# EAGLE design relayBoard (EAGLE 7.5.0)
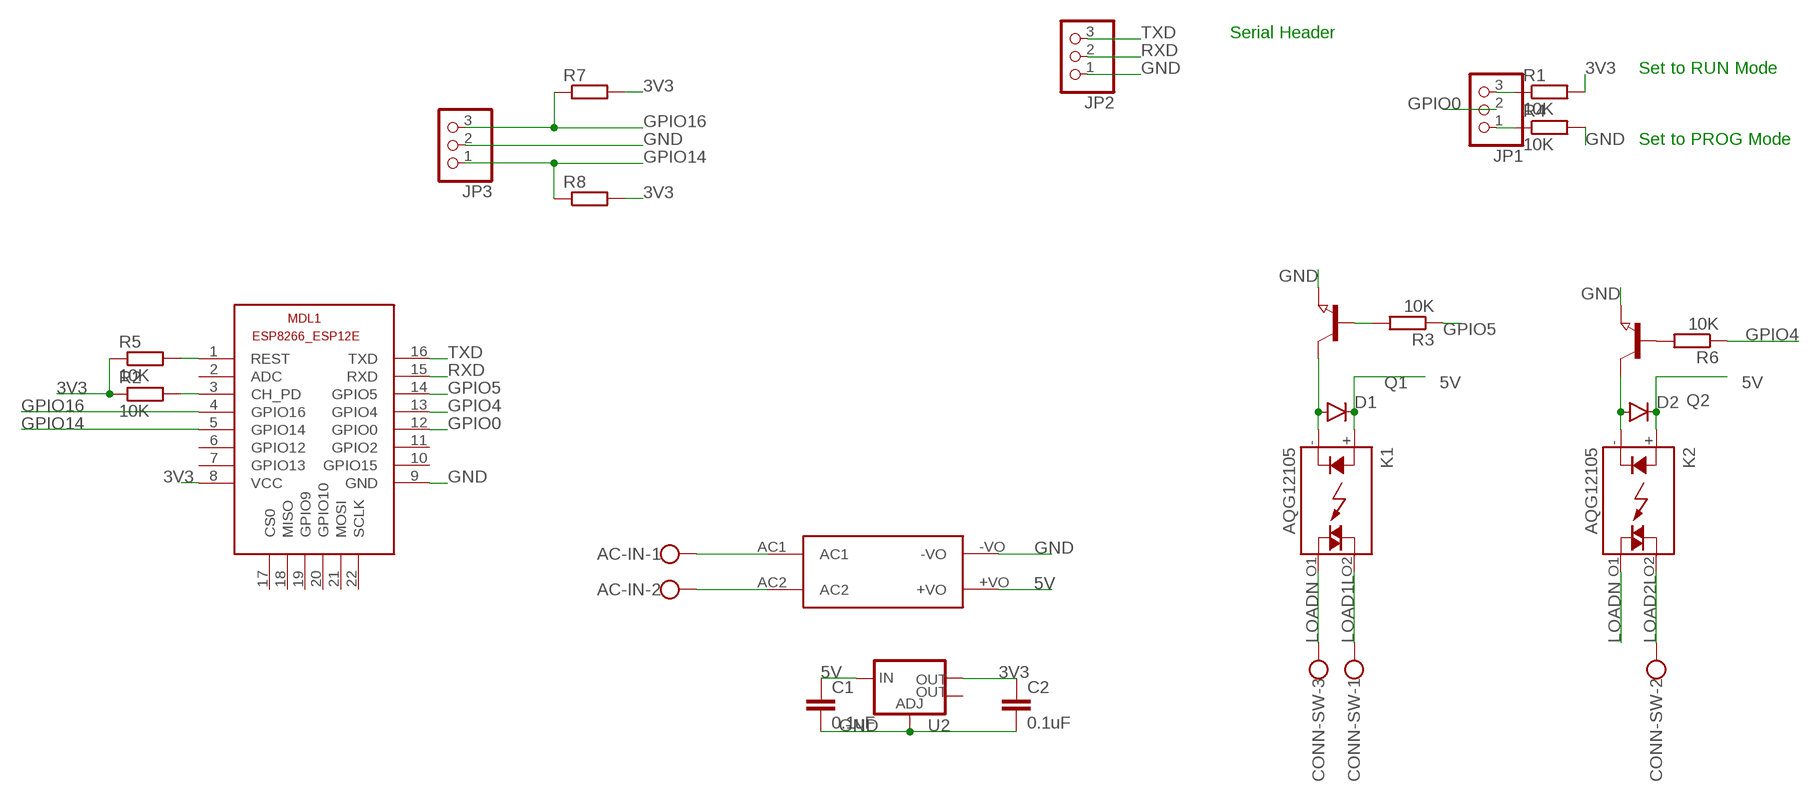
[diagram p0: schematic, sheet 1]

## Parts
AC-IN  W237-102  [W237-102]
C1  0.1uF  0.1UF-25V-5%(0603)  [0603-CAP]
C2  0.1uF  0.1UF-25V-5%(0603)  [0603-CAP]
CONN-SW  W237-103  [W237-103]
D1  DIODESMA  [SMA-DIODE]
D2  DIODESMA  [SMA-DIODE]
JP1  PINHD-1X3  [1X03]
JP2  PINHD-1X3  [1X03]
JP3  PINHD-1X3  [1X03]
K1  AQG12105  [AQG]
K2  AQG12105  [AQG]
MDL1  ESP8266-12EESP8266-ESP12E  [ESP8266-ESP12E]
Q1  NPN-TRANSISTOR_SOT23  [SOT23]
Q2  NPN-TRANSISTOR_SOT23  [SOT23]
R1  10K  R-EU_R0805  [R0805]
R2  10K  R-EU_R0805  [R0805]
R3  10K  R-EU_R0805  [R0805]
R4  10K  R-EU_R0805  [R0805]
R5  10K  R-EU_R0805  [R0805]
R6  10K  R-EU_R0805  [R0805]
R7  R-EU_R0805  [R0805]
R8  R-EU_R0805  [R0805]
U2  V_REG_LM1117SOT223  [SOT223]
U$4  HLK-PM01  [HLK-PM01]

## Nets
3V3: C2.1 MDL1.8(VCC) R1.2 R2.1 R5.1 R7.2 R8.2 U2.2(OUT)
5V: C1.1 D1.C D2.C K1.+(A) K2.+(A) U2.3(IN) U$4.+VO
GND: C1.2 C2.2 JP2.1 JP3.2 MDL1.9(GND) Q1.2(E) Q2.2(E) R4.2 U2.1(ADJ) U$4.-VO
GPIO0: JP1.2 MDL1.12(GPIO0)
GPIO4: MDL1.13(GPIO4) R6.1
GPIO5: MDL1.14(GPIO5) R3.1
GPIO14: JP3.1 MDL1.5(GPIO14) R8.1
GPIO16: JP3.3 MDL1.4(GPIO16) R7.1
LOAD1L [ac]: CONN-SW.1 K1.O2(DS1)
LOAD2L [ac]: CONN-SW.2 K2.O2(DS1)
LOADN [ac]: CONN-SW.3 K1.O1(DS2) K2.O1(DS2)
N$1: JP1.3 R1.1
N$2 [ac]: AC-IN.1 U$4.AC1
N$3: JP1.1 R4.1
N$5 [ac]: AC-IN.2 U$4.AC2
N$6: MDL1.1(REST) R5.2
N$7: D2.A K2.-(K) Q2.3(C)
N$8: Q2.1(B) R6.2
N$9: MDL1.3(CH_PD) R2.2
N$10: D1.A K1.-(K) Q1.3(C)
N$12: Q1.1(B) R3.2
RXD: JP2.2 MDL1.15(RXD)
TXD: JP2.3 MDL1.16(TXD)
Unconnected: MDL1.2(ADC) MDL1.6(GPIO12) MDL1.7(GPIO13) MDL1.10(GPIO15) MDL1.11(GPIO2) MDL1.17(CS0) MDL1.18(MISO) MDL1.19(GPIO9) MDL1.20(GPIO10) MDL1.21(MOSI) MDL1.22(SCLK) U2.4(OUT)

## Notes on the sheet
- Serial Header
- Set to RUN Mode
- Set to PROG Mode

## Library data of the parts
AC-IN = con-wago-500:W237-102: WAGO SCREW CLAMP; MPN: 237-102; OC_FARNELL: unknown; OC_NEWARK: 70K9898
C1 C2 = SparkFun-Capacitors:0.1UF-25V-5%(0603): CAP-08604; PROD_ID: CAP-08604
CONN-SW = con-wago-500:W237-103: WAGO SCREW CLAMP; MPN: 237-103; OC_FARNELL: unknown; OC_NEWARK: 18M7116
D1 D2 = SparkFun-DiscreteSemi:DIODE: Diode These are standard reverse protection diodes and small signal diodes. SMA package can handle up to about 1A. SOD-323 can handle about 200mA. What the SOD-323 package when ordering, there are some mfgs out there that are 5-pin packages.
JP1-JP3 = pinhead:PINHD-1X3: PIN HEADER
K1 K2 = relay:AQG*: SOLID STATE RELAY NAiS Zero-cross, Non zero-cross Source: http://www.mew-europe.com/.. en_ds_61611_0000.pdf; MF: AROMAT/ MATSUSHITA; MPN: AQG12105; OC_FARNELL: unknown; OC_NEWARK: 20J4759
MDL1 = ESP8266-ESP12E:ESP8266-12E: ESP8266-12E with additional I/O and GPIO04/05 corrected The author cannot warrant that this library is free from error or will meet your specific requirements. Created by PuceBaboon.com. Komagane, Nagano, JAPAN
Q1 Q2 = semicon-smd-ipc:NPN-TRANSISTOR_: NPN TRANSISTOR
R1-R8 = resistor:R-EU_: RESISTOR, European symbol
U2 = SparkFun-PowerIC:V_REG_LM1117: Voltage Regulator LM1117 Standard adjustable voltage regulator but in SMD form. Spark Fun Electronics SKU : COM-00595; PROD_ID: VREG-08170
U$4 = hlk-pm01:HLK-PM01

## Net classes
0 default: width 0.152 mm, drill 0.305 mm, clearance 0.152 mm
1 ac: width 1.27 mm, drill 1.27 mm, clearance 2.54 mm

## Board
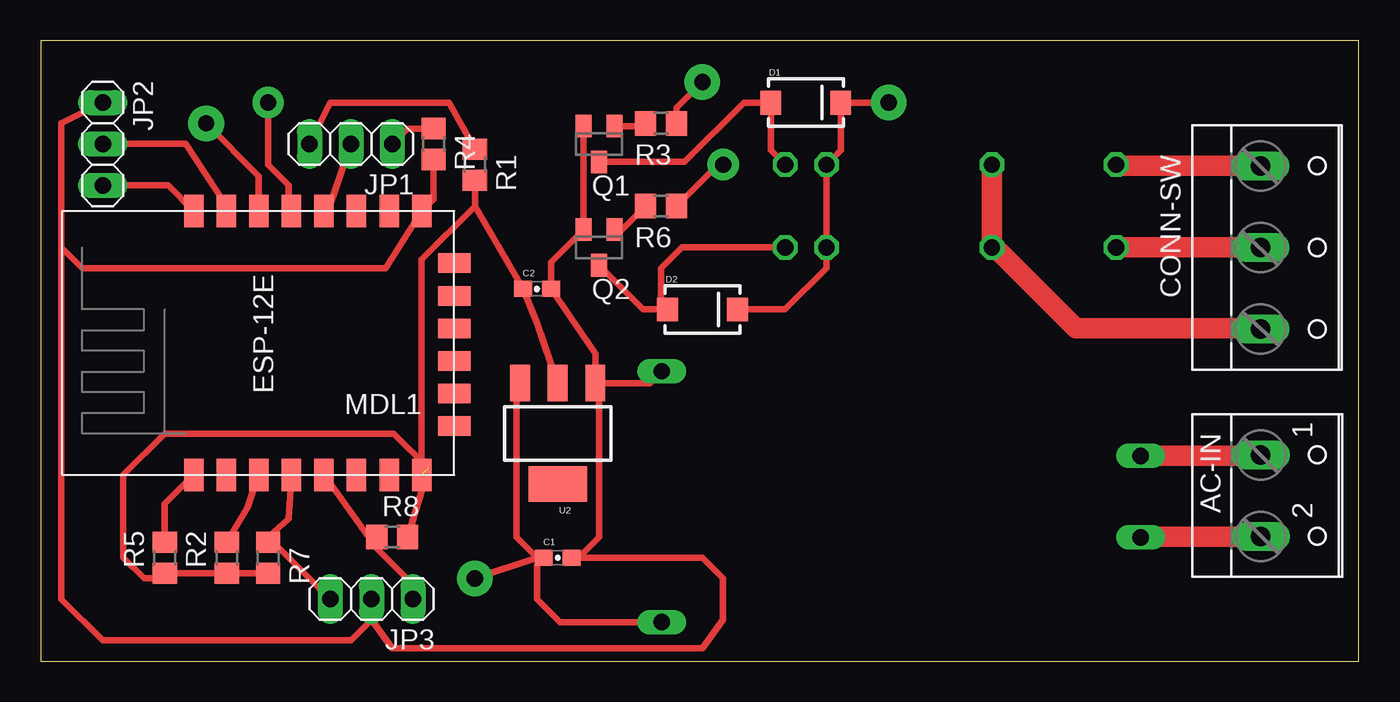
[diagram p1: board, top side]
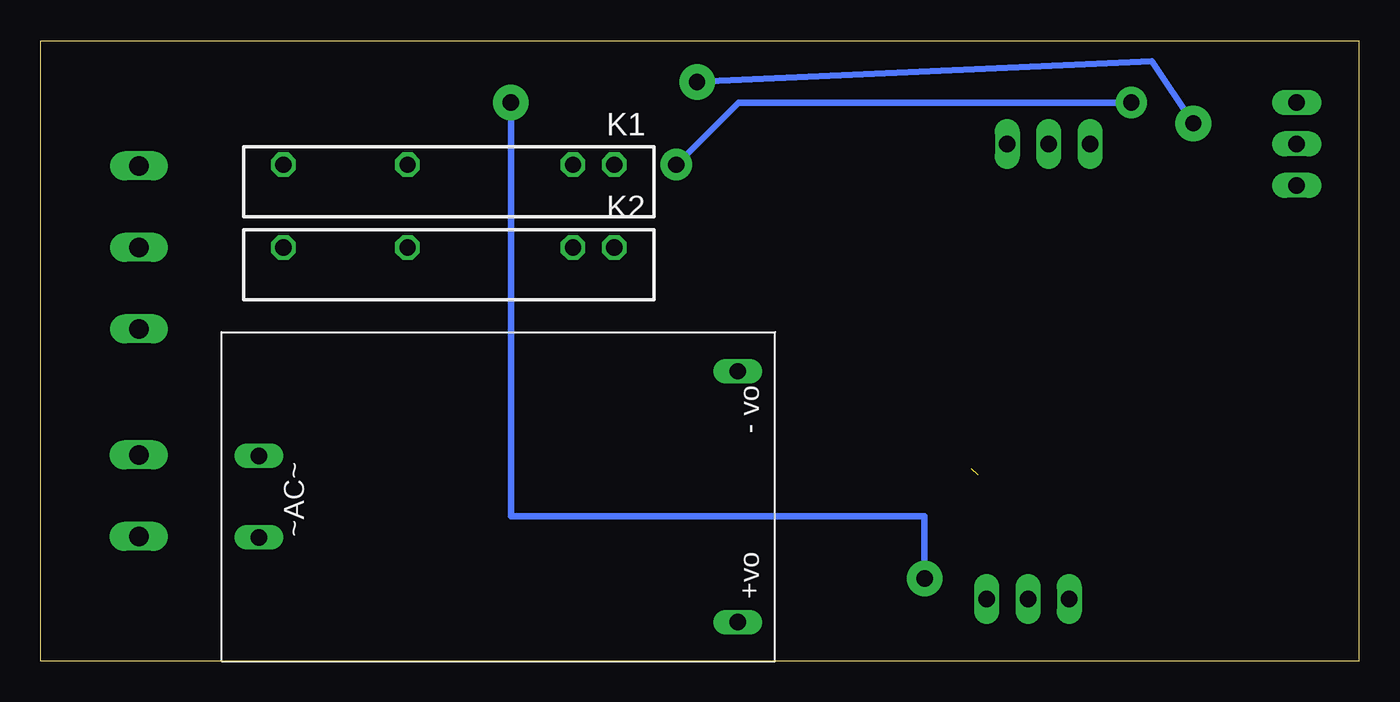
[diagram p2: board, bottom side, seen from below]

Size 80.95 x 38.09 mm. Coordinates in mm from the lower left corner, seen from the top.
Outline: 0,0 80.95,0 80.95,38.09 0,38.09 0,0
Copper layers (1*16): Top 0.035mm / dielectric 1.5mm / Bottom 0.035mm
Design rules "ShenZhen2U EagleRules": minimum track width 7mil, minimum drill 12mil, track to track 7mil, track to pad 7mil, pad to pad 7mil, via to via 7mil, smd to smd 0mil, copper to edge 20mil, drill to drill 10mil, minimum pad ring 10mil, minimum via ring 6mil, stop-mask expansion 2mil, vias tented up to drill 25mil, thermal gap 10mil

### Footprints (pad centres in the part's own frame; a part is rotated, then mirrored left to right if it is on the bottom)
W237-102 = drill 1.194 long: 1 -2.5,-1.27; 2 2.5,-1.27
0603-CAP = smd 1.1 x 1: 1 -0.85,0; 2 0.85,0
W237-103 = drill 1.194 long: 1 -5,-1.29; 2 0,-1.29; 3 5,-1.29
SMA-DIODE = smd 1.27 x 1.47: A -2.15,0; C 2.15,0
1X03 = drill 1.016 long: 1 -2.54,0; 2 0,0; 3 2.54,0
AQG = drill 1 octagon: + -7.62,0; - -10.16,0; O1 2.54,0; O2 10.16,0
ESP8266-ESP12E = smd 2 x 1.2: 1 0,16; 2 0,14; 3 0,12; 4 0,10; 5 0,8; 6 0,6; 7 0,4; 8 0,2; 9 16.2,2; 10 16.2,4; 11 16.2,6; 12 16.2,8; 13 16.2,10; 14 16.2,12; 15 16.2,14; 16 16.2,16 | smd 1.2 x 2: 17 11,0; 18 3,0; 19 5,0; 20 13,0; 21 7,0; 22 9,0
SOT23 = smd 1 x 1.4: 1 -0.95,-1.1; 2 0.95,-1.1; 3 0,1.1
R0805 = smd 1.3 x 1.5: 1 -0.95,0; 2 0.95,0
SOT223 = smd 1.219 x 2.235: 1 -2.311,-3.099; 2 0,-3.099; 3 2.311,-3.099 | smd 3.6 x 2.2: 4 0,3.099
HLK-PM01 = drill 1 long: +VO 31.7,2.4; -VO 31.7,17.8; AC1 2.3,12.6; AC2 2.3,7.6

### Placement (x,y rotation side)
AC-IN  76.2,10.16 270 top
C1  31.75,6.35 0 top
C2  30.48,22.86 0 top
CONN-SW  76.2,25.4 270 top
D1  46.99,34.29 0 top
D2  40.64,21.59 0 top
JP1  19.05,31.75 180 top
JP2  3.81,31.75 270 top
JP3  20.32,3.81 180 top
K1  55.88,30.48 180 bottom
K2  55.88,25.4 180 bottom
MDL1  25.4,11.43 90 top
Q1  34.29,31.75 180 top
Q2  34.29,25.4 180 top
R1  26.67,30.48 270 top
R2  11.43,6.35 90 top
R3  38.1,33.02 180 top
R4  24.13,31.75 270 top
R5  7.62,6.35 90 top
R6  38.1,27.94 180 top
R7  13.97,6.35 270 top
R8  21.59,7.62 0 top
U2  31.75,13.97 180 top
U$4  69.85,0 0 bottom

### Tracks (layer width: path | path; a pad name or v marks a point on that pad's centre or on a via)
3V3  (1 unrouted)
  Top 0.406: R7.2 R2.1 R5.1 7.3,5.08 6.35,5.08 5.08,6.35 5.08,11.43 7.62,13.97 21.68,13.97 23.81,11.84 R8.2 | U2.2 30.48,20.74 C2.1 26.67,27.94 | MDL1.8 23.4,24.67 26.67,27.94 | 26.67,27.94 R1.2
5V  (via drill 1 pad 2.18)
  Top 0.406: U$4.+VO 31.89,2.4 30.48,3.81 30.48,5.93 C1.1 30.48,6.35 | 30.48,6.35 29.21,7.62 29.21,16.84 U2.3 | D2.C 45.72,21.59 48.26,24.13 K2.+ K1.+ 49.14,31.36 D1.C v52.07,34.29 | 30.48,6.35 v26.67,5.08
  Bottom 0.406: v26.67,5.08 26.67,8.89 52.07,8.89 v52.07,34.29
GND
  Top 0.406: 20.32,2.54 19.05,1.27 3.81,1.27 1.27,3.81 1.27,25.4 | 1.27,25.4 1.27,33.02 JP2.1 | C1.2 33.02,6.35 | 33.02,6.35 34.29,7.62 34.29,16.84 U2.1 | JP3.2 20.32,2.54 | 20.32,2.54 21.59,0.8 40.64,0.8 41.91,2.54 41.91,5.08 40.64,6.35 33.02,6.35 | Q1.2 Q2.2 31.33,24.49 C2.2 34.06,18.86 U2.1 | U2.1 37.42,17.07 U$4.-VO | R4.2 24.13,28.36 MDL1.9 21.17,24.13 2.54,24.13 1.27,25.4
GPIO0
  Top 0.406: JP1.2 17.78,28.01 MDL1.12
GPIO4  (via drill 1 pad 1.93)
  Top 0.406: R6.1 41.59,30.48 v41.91,30.48 | v13.97,34.29 13.97,30.48 15.24,29.21 15.24,27.79 MDL1.13
  Bottom 0.406: v41.91,30.48 38.1,34.29 v13.97,34.29
GPIO5  (via drill 1 pad 2.18)
  Top 0.406: R3.1 39.05,33.97 v40.64,35.56 | v10.16,33.02 13.4,29.78 MDL1.14
  Bottom 0.406: v40.64,35.56 12.7,36.83 v10.16,33.02
GPIO14
  Top 0.406: JP3.1 22.86,4.7 20.64,6.92 | R8.1 20.64,6.92 | 20.64,6.92 MDL1.5
GPIO16
  Top 0.406: R7.1 13.97,7.62 | JP3.3 13.97,7.62 | 13.97,7.62 15.24,8.73 MDL1.4
LOAD1L
  Top 1.27: K1.O2 66.05,30.4 74.85,30.4 CONN-SW.1
LOAD2L
  Top 1.27: K2.O2 66.05,25.43 74.85,25.43 CONN-SW.2
LOADN
  Top 1.27: K1.O1 58.41,30.4 58.41,25.43 K2.O1 58.94,25.07 63.56,20.45 74.85,20.45 CONN-SW.3
N$1
  Top 0.406: R1.1 25.08,34.29 17.78,34.29 JP1.3
N$2
  Top 1.27: U$4.AC1 67.56,12.62 74.85,12.62 AC-IN.1
N$3
  Top 0.406: R4.1 22.54,32.7 JP1.1
N$5
  Top 1.27: U$4.AC2 67.56,7.64 74.85,7.64 AC-IN.2
N$6
  Top 0.406: R5.2 7.62,9.65 MDL1.1
N$7
  Top 0.406: K2.- 39.37,25.4 38.1,24.13 38.1,21.98 D2.A 37,21.59 Q2.3
N$8
  Top 0.406: Q2.1 35.71,26.5 R6.2
N$9
  Top 0.406: R2.2 12.7,9.46 MDL1.3
N$10
  Top 0.406: K1.- 44.84,31.36 D1.A 43.18,34.29 39.54,30.65 Q1.3
N$12
  Top 0.406: Q1.1 36.98,32.85 R3.2
RXD
  Top 0.406: JP2.2 8.89,31.75 11.43,27.94 11.43,27.66 MDL1.15
TXD
  Top 0.406: JP2.3 7.82,29.21 MDL1.16